# Altium project FHJController_V5.0.PrjPcb (part 1 of 2)
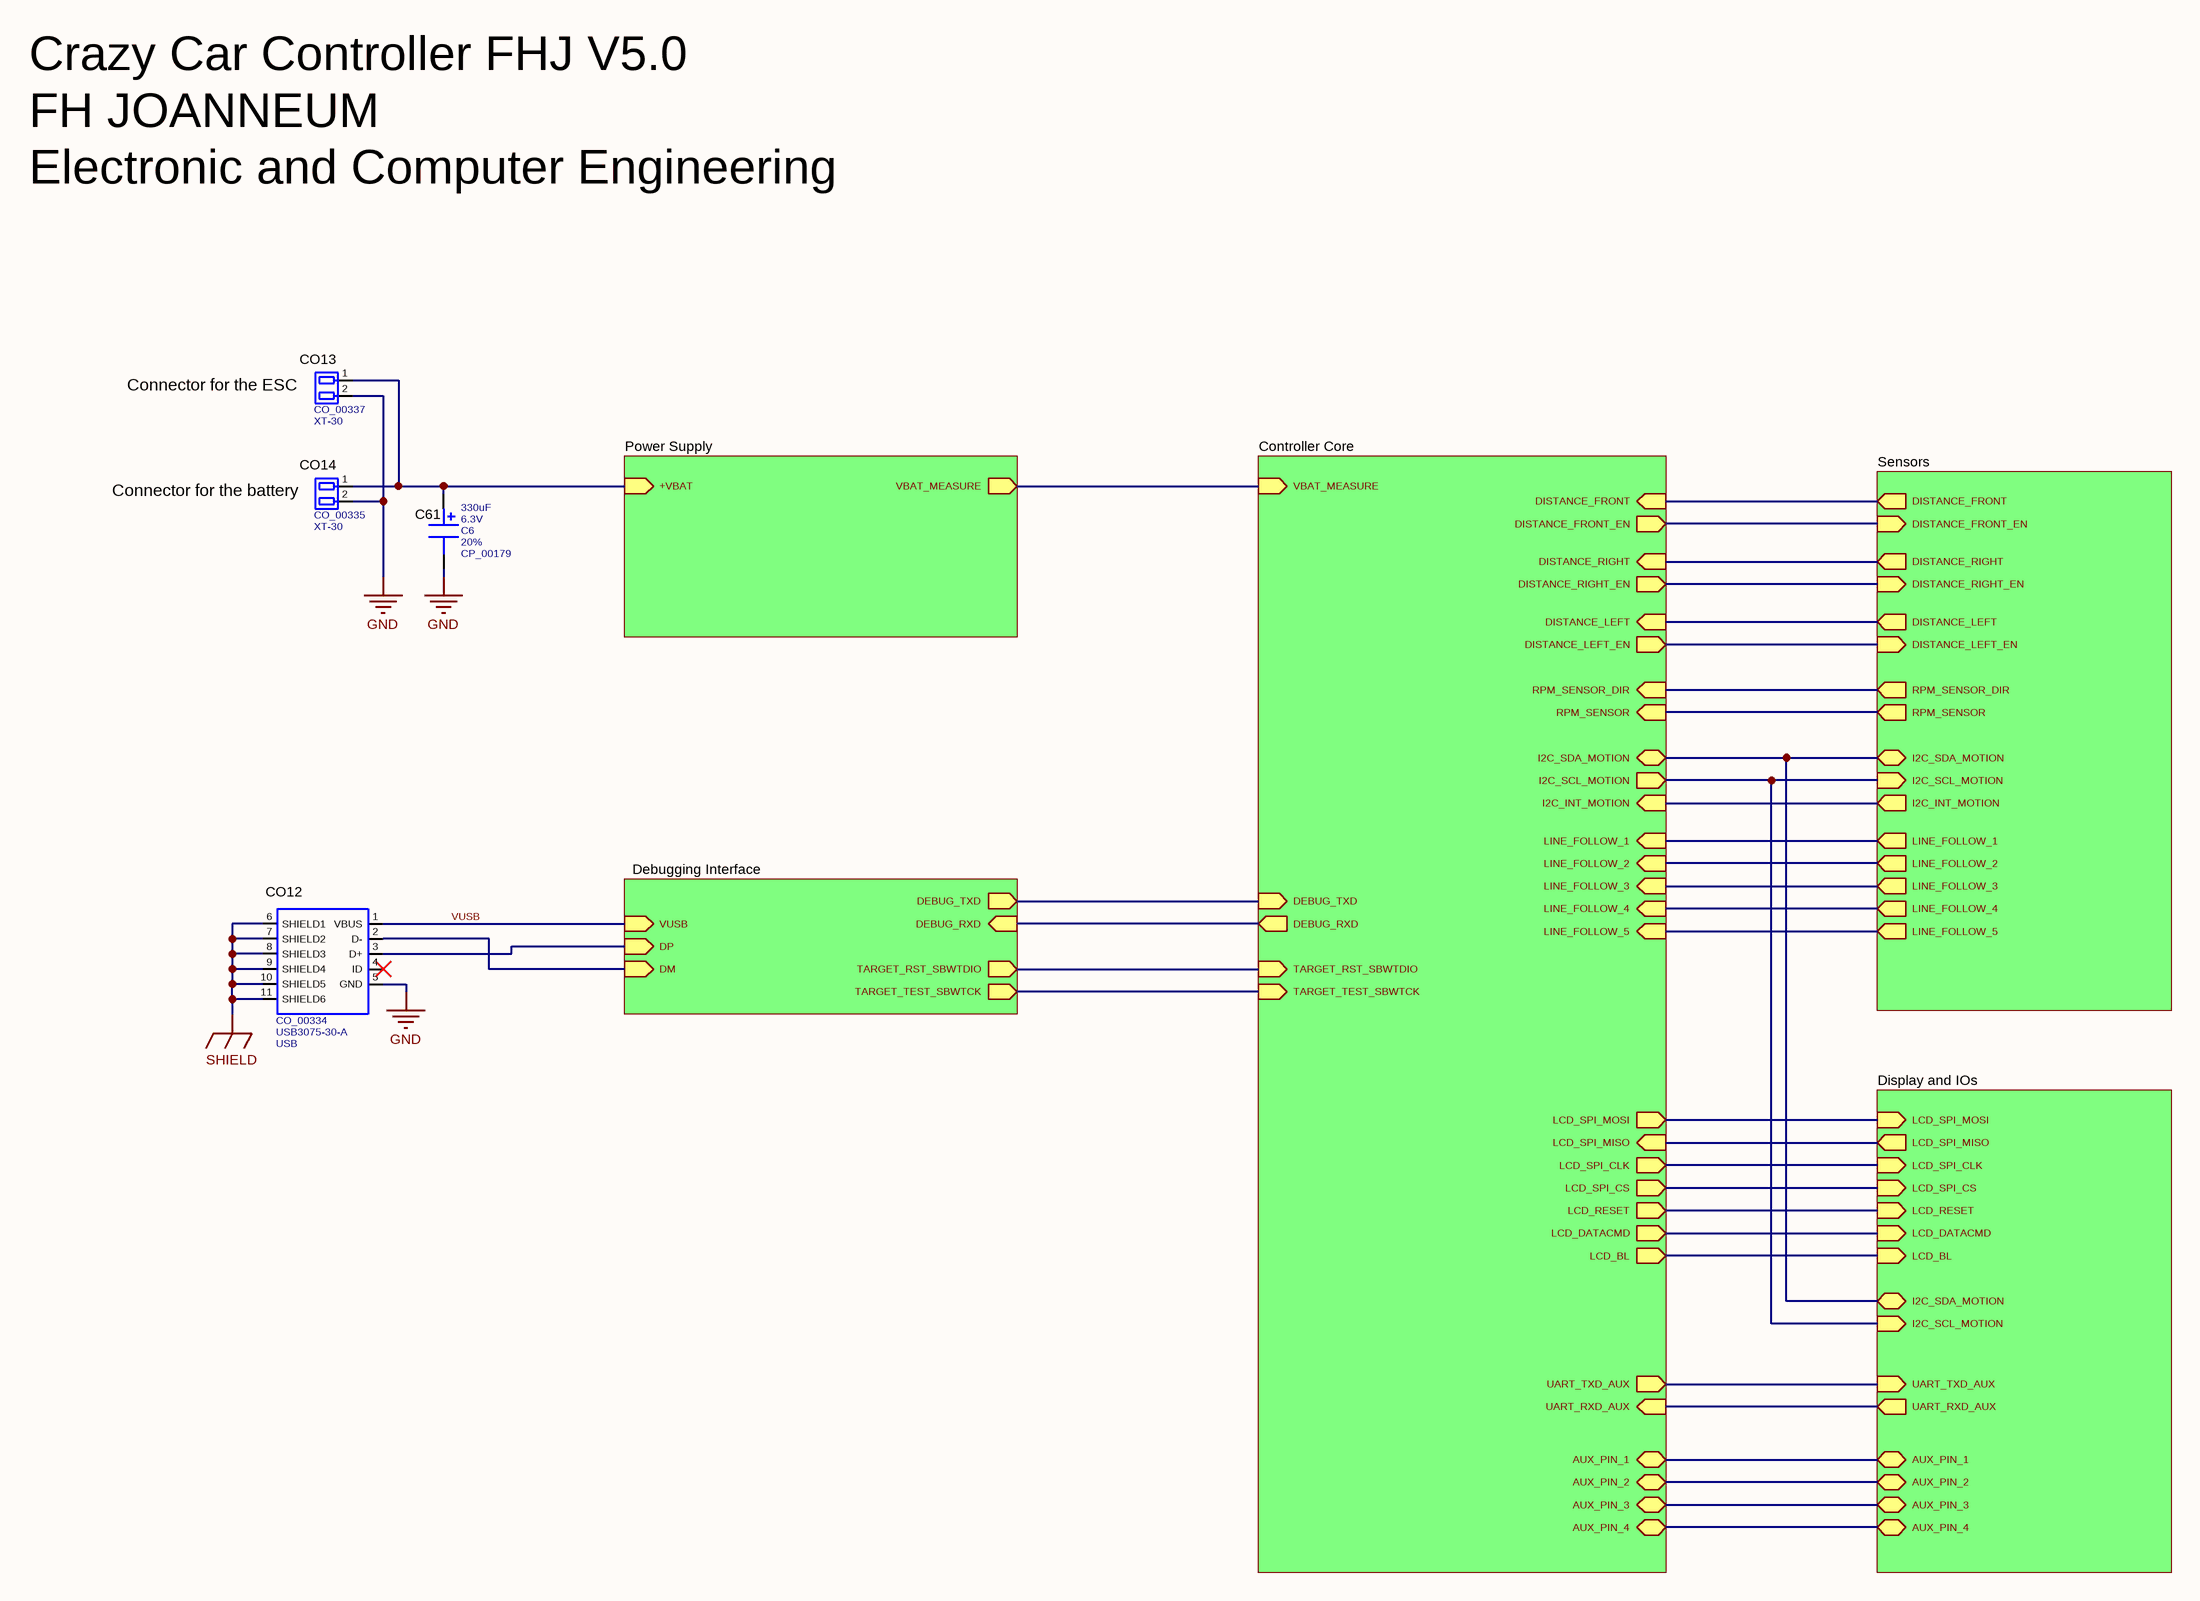
[diagram p0: FHJController_V5.0_Main.SchDoc]
Address1: Werk-VI-Straße 46; Address2: 8605 Kapfenberg; checked: Markus Krenn; CompanyName: FH JOANNEUM; Country: AUSTRIA; drawn: Markus Krenn; ProjectTitle: Crazy Car Controller FHJ; Rev: 5.0
6 sheets, 159 parts. Net scope: hierarchical (ports join the sheet entries above them; power ports are global).
Board file: FHJController_V5.0.PcbDoc
Sheets:
  FHJController_V5.0_Main.SchDoc
     = Power Supply.SchDoc
     = Controller Core.SchDoc
     = Debugging Interface.SchDoc
     = Sensors.SchDoc
     = Display and IOs.SchDoc

## Sheet FHJController_V5.0_Main.SchDoc: Main
size A3; DocumentNumber: 1; SheetNumber: 1; SheetTotal: 6

### Parts
C61  Capacitance: 330uF  Voltage: 6.3V  Package: C6  Tolerance: 20%  Part_Number: CP_00179  [CP_00179L]  (hidden comment: capacitor_polar)
CO12  Manufacturer_Number: USB3075-30-A  Connector_Type: USB  [CO_00334N]  (hidden comment: CO_00334)
CO13  Part_Number: CO_00337  Manufacturer_Number: XT-30  [CO_00337N]  (hidden comment: header1x2)
CO14  Part_Number: CO_00335  Manufacturer_Number: XT-30  [CO_00335N]  (hidden comment: header1x2)

### Sub-sheets
? = Power Supply: +VBAT (in), VBAT_MEASURE (out)
? = Controller Core: LCD_BL (out), UART_RXD_AUX (in), LCD_SPI_CLK (out), DEBUG_RXD (out), LCD_DATACMD (out), LCD_SPI_MOSI (out), LCD_SPI_CS (out), DEBUG_TXD (in), LCD_RESET (out), LCD_SPI_MISO (in), TARGET_RST_SBWTDIO (in), UART_TXD_AUX (out), I2C_SCL_MOTION (out), I2C_INT_MOTION (in), I2C_SDA_MOTION (bidir), RPM_SENSOR (in), RPM_SENSOR_DIR (in), DISTANCE_FRONT (in), DISTANCE_FRONT_EN (out), DISTANCE_RIGHT (in), DISTANCE_RIGHT_EN (out), DISTANCE_LEFT (in), DISTANCE_LEFT_EN (out), VBAT_MEASURE (in), LINE_FOLLOW_1 (in), LINE_FOLLOW_3 (in), LINE_FOLLOW_2 (in), LINE_FOLLOW_4 (in), LINE_FOLLOW_5 (in), TARGET_TEST_SBWTCK (in), AUX_PIN_2 (bidir), AUX_PIN_4 (bidir), AUX_PIN_3 (bidir), AUX_PIN_1 (bidir)
? = Debugging Interface: VUSB (in), DP (in), DM (in), DEBUG_TXD (out), DEBUG_RXD (in), TARGET_TEST_SBWTCK (out), TARGET_RST_SBWTDIO (out)
? = Sensors: RPM_SENSOR_DIR (out), RPM_SENSOR (out), DISTANCE_FRONT (out), DISTANCE_RIGHT (out), DISTANCE_LEFT (out), I2C_SDA_MOTION (bidir), I2C_SCL_MOTION (in), DISTANCE_RIGHT_EN (in), DISTANCE_FRONT_EN (in), DISTANCE_LEFT_EN (in), LINE_FOLLOW_5 (out), LINE_FOLLOW_1 (out), LINE_FOLLOW_3 (out), LINE_FOLLOW_2 (out), LINE_FOLLOW_4 (out), I2C_INT_MOTION (out)
? = Display and IOs: LCD_SPI_CLK (in), UART_TXD_AUX (in), LCD_SPI_MOSI (in), LCD_BL (in), LCD_SPI_CS (in), LCD_DATACMD (in), UART_RXD_AUX (out), LCD_RESET (in), LCD_SPI_MISO (out), I2C_SCL_MOTION (in), I2C_SDA_MOTION (bidir), AUX_PIN_1 (bidir), AUX_PIN_3 (bidir), AUX_PIN_4 (bidir), AUX_PIN_2 (bidir)

### Nets
GND: C61.2(PIN2) CO12.5(GND) CO13.2(PIN2) CO14.2(PIN2)
SHIELD: CO12.6(SHIELD1) CO12.7(SHIELD2) CO12.8(SHIELD3) CO12.9(SHIELD4) CO12.10(SHIELD5) CO12.11(SHIELD6)
AUX_PIN_1: sheet /AUX_PIN_1, sheet /AUX_PIN_1
AUX_PIN_2: sheet /AUX_PIN_2, sheet /AUX_PIN_2
AUX_PIN_3: sheet /AUX_PIN_3, sheet /AUX_PIN_3
AUX_PIN_4: sheet /AUX_PIN_4, sheet /AUX_PIN_4
DEBUG_RXD: sheet /DEBUG_RXD, sheet /DEBUG_RXD
DEBUG_TXD: sheet /DEBUG_TXD, sheet /DEBUG_TXD
DISTANCE_FRONT: sheet /DISTANCE_FRONT, sheet /DISTANCE_FRONT
DISTANCE_FRONT_EN: sheet /DISTANCE_FRONT_EN, sheet /DISTANCE_FRONT_EN
DISTANCE_LEFT: sheet /DISTANCE_LEFT, sheet /DISTANCE_LEFT
DISTANCE_LEFT_EN: sheet /DISTANCE_LEFT_EN, sheet /DISTANCE_LEFT_EN
DISTANCE_RIGHT: sheet /DISTANCE_RIGHT, sheet /DISTANCE_RIGHT
DISTANCE_RIGHT_EN: sheet /DISTANCE_RIGHT_EN, sheet /DISTANCE_RIGHT_EN
I2C_INT_MOTION: sheet /I2C_INT_MOTION, sheet /I2C_INT_MOTION
I2C_SCL_MOTION: sheet /I2C_SCL_MOTION, sheet /I2C_SCL_MOTION, sheet /I2C_SCL_MOTION
I2C_SDA_MOTION: sheet /I2C_SDA_MOTION, sheet /I2C_SDA_MOTION, sheet /I2C_SDA_MOTION
LCD_BL: sheet /LCD_BL, sheet /LCD_BL
LCD_DATACMD: sheet /LCD_DATACMD, sheet /LCD_DATACMD
LCD_RESET: sheet /LCD_RESET, sheet /LCD_RESET
LCD_SPI_CLK: sheet /LCD_SPI_CLK, sheet /LCD_SPI_CLK
LCD_SPI_CS: sheet /LCD_SPI_CS, sheet /LCD_SPI_CS
LCD_SPI_MISO: sheet /LCD_SPI_MISO, sheet /LCD_SPI_MISO
LCD_SPI_MOSI: sheet /LCD_SPI_MOSI, sheet /LCD_SPI_MOSI
LINE_FOLLOW_1: sheet /LINE_FOLLOW_1, sheet /LINE_FOLLOW_1
LINE_FOLLOW_2: sheet /LINE_FOLLOW_2, sheet /LINE_FOLLOW_2
LINE_FOLLOW_3: sheet /LINE_FOLLOW_3, sheet /LINE_FOLLOW_3
LINE_FOLLOW_4: sheet /LINE_FOLLOW_4, sheet /LINE_FOLLOW_4
LINE_FOLLOW_5: sheet /LINE_FOLLOW_5, sheet /LINE_FOLLOW_5
RPM_SENSOR: sheet /RPM_SENSOR, sheet /RPM_SENSOR
RPM_SENSOR_DIR: sheet /RPM_SENSOR_DIR, sheet /RPM_SENSOR_DIR
TARGET_RST_SBWTDIO: sheet /TARGET_RST_SBWTDIO, sheet /TARGET_RST_SBWTDIO
TARGET_TEST_SBWTCK: sheet /TARGET_TEST_SBWTCK, sheet /TARGET_TEST_SBWTCK
UART_RXD_AUX: sheet /UART_RXD_AUX, sheet /UART_RXD_AUX
UART_TXD_AUX: sheet /UART_TXD_AUX, sheet /UART_TXD_AUX
VBAT_MEASURE: sheet /VBAT_MEASURE, sheet /VBAT_MEASURE
VUSB: CO12.1(VBUS) ; sheet /VUSB
NetC61_1: C61.1(PIN1) CO13.1(PIN1) CO14.1(PIN1) ; sheet /+VBAT
NetCO12_2: CO12.2(D-) ; sheet /DM
NetCO12_3: CO12.3(D+) ; sheet /DP

Not connected (* = marked no-connect by the designer): CO12 4(ID)*

### Notes on the sheet
- Crazy Car Controller FHJ V5.0
- FH JOANNEUM
- Electronic and Computer Engineering
- (near CO13) Connector for the ESC
- (near CO14) Connector for the battery
- Size
- A3
- Rev
- Sheet
- of
- Date changed
- FH  JOANNEUM
- University of Applied Sciences
- Drawn by
- Title
- Check by

### Library data of the parts
C61 = CP_00179: Manufacturer_Number: 875105144010; ESR: 0R02; Dielectric_Material: Conductive Polymer Aluminum Solid; Creator: Krenn Markus; Creation_Date: 13.06.2016; Datasheet_Link: http://ibi/dxdb_partdatasheet_download.php?pid=3183
CO12 = CO_00334: Micro-USB Typ B, USB 2.0, Buchse, 5 -polig, Oberflächenmontage, Rechtwinklig; Current: 1A; Impedance: 0R03; Power: 0W; Function_type: Wire-to-Board; Connector_gender: male; Mounting_angle: 90°; Contact_Count: 5; Row_Count: 1; Contact_coating: Gold; Nominal_AC_Voltage: 100VAC; Nominal_DC_Voltage: 100VDC; Mounting: SMD; Material: Copper-Alloy; Creator: Krenn Markus; Part_Number: CO_00334; Creation_Date: 06.06.2016; Datasheet_Link: http://ibi/dxdb_partdatasheet_download.php?pid=3170
CO13 = CO_00337: DYMOND XT-30 BEC Stecker; Current: 5A; Impedance: 0R; Power: 0W; Connector_Type: Terminal Block; Function_type: Wire-to-Board; Connector_gender: female; Pitch_style: 0.005m; Mounting_angle: 0°; Contact_Count: 2; Row_Count: 1; Contact_coating: Gold; Nominal_AC_Voltage: 0VAC; Nominal_DC_Voltage: 0VDC; Mounting: Through Hole; Material: Copper-Alloy; Creator: Krenn Markus; Creation_Date: 10.06.2016; Datasheet_Link: http://ibi/dxdb_partdatasheet_download.php?pid=3181
CO14 = CO_00335: DYMOND XT-30 BEC Stecker; Current: 5A; Impedance: 0R; Power: 0W; Connector_Type: Terminal Block; Function_type: Wire-to-Board; Connector_gender: male; Pitch_style: 0.005m; Mounting_angle: 0°; Contact_Count: 2; Row_Count: 1; Contact_coating: Gold; Nominal_AC_Voltage: 0VAC; Nominal_DC_Voltage: 0VDC; Mounting: Through Hole; Material: Copper-Alloy; Creator: Krenn Markus; Creation_Date: 07.06.2016; Datasheet_Link: http://ibi/dxdb_partdatasheet_download.php?pid=3173

## Sheet Power Supply.SchDoc: Power Supply
size A3; DocumentNumber: 2; SheetNumber: 2; SheetTotal: 6
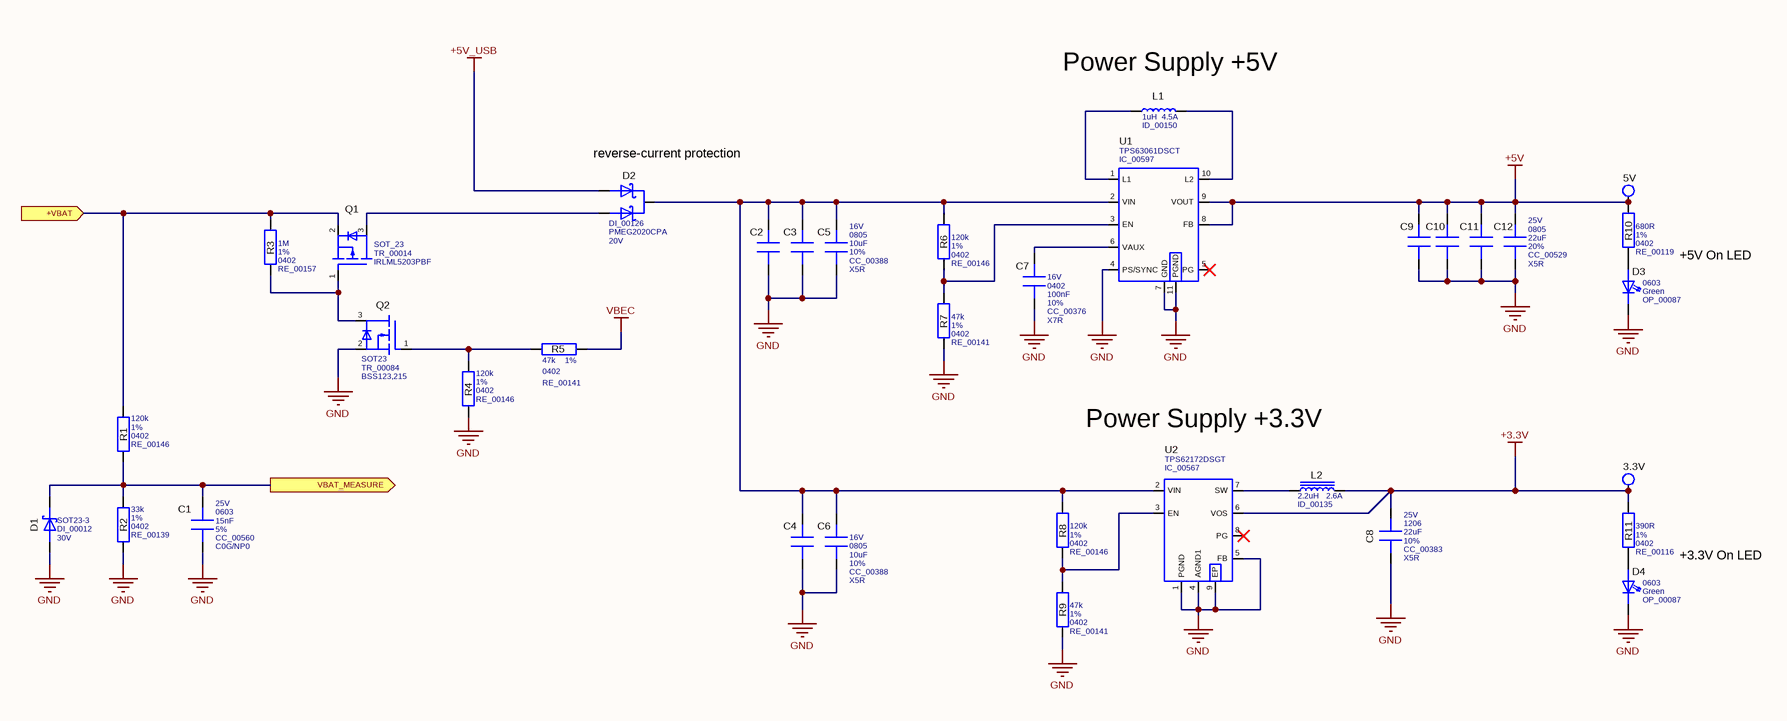
[diagram p1: Power Supply.SchDoc]

### Parts
3.3V  testpoint  [CO_00057N]  (value not drawn)  (no BOM)
5V  testpoint  [CO_00057N]  (value not drawn)  (no BOM)
C1  Voltage: 25V  Package: 0603  Capacitance: 15nF  Tolerance: 5%  Part_Number: CC_00560  Dielectric_Material: C0G/NP0  [CS1600X800X900X350X1250L]  (hidden comment: capacitor)
C2  capacitor  [CS2000x1250x1250x350x1650L]  (value not drawn)
C3  capacitor  [CS2000x1250x1250x350x1650L]  (value not drawn)
C4  capacitor  [CS2000x1250x1250x350x1650L]  (value not drawn)
C5  Voltage: 16V  Package: 0805  Capacitance: 10uF  Tolerance: 10%  Part_Number: CC_00388  Dielectric_Material: X5R  [CS2000x1250x1250x350x1650L]  (hidden comment: capacitor)
C6  Voltage: 16V  Package: 0805  Capacitance: 10uF  Tolerance: 10%  Part_Number: CC_00388  Dielectric_Material: X5R  [CS2000x1250x1250x350x1650L]  (hidden comment: capacitor)
C7  Voltage: 16V  Package: 0402  Capacitance: 100nF  Tolerance: 10%  Part_Number: CC_00376  Dielectric_Material: X7R  [CS1000X500X560X250X820L]  (hidden comment: capacitor)
C8  Voltage: 25V  Package: 1206  Capacitance: 22uF  Tolerance: 10%  Part_Number: CC_00383  Dielectric_Material: X5R  [CS3200x1600x900x500x2700L]  (hidden comment: capacitor)
C9  capacitor  [CS2000x1250x1250x350x1650L]  (value not drawn)
C10  capacitor  [CS2000x1250x1250x350x1650L]  (value not drawn)
C11  capacitor  [CS2000x1250x1250x350x1650L]  (value not drawn)
C12  Voltage: 25V  Package: 0805  Capacitance: 22uF  Tolerance: 20%  Part_Number: CC_00529  Dielectric_Material: X5R  [CS2000x1250x1250x350x1650L]  (hidden comment: capacitor)
D1  Package: SOT23-3  Reverse_Voltage: 30V  [DI_00012N]  (hidden comment: DI_00012)
D2  Manufacturer_Number: PMEG2020CPA  Reverse_Voltage: 20V  [DI_00126N]  (hidden comment: DI_00126)
D3  Package: 0603  Color: Green  Part_Number: OP_00087  [OP_00087L]  (hidden comment: LED)
D4  Package: 0603  Color: Green  Part_Number: OP_00087  [OP_00087L]  (hidden comment: LED)
L1  Inductance: 1uH  Part_Number: ID_00150  Current_DC: 4.5A  [ID_00150N]  (hidden comment: inductor)
L2  Inductance: 2.2uH  Part_Number: ID_00135  Current_DC: 2.6A  [ID_00135N]  (hidden comment: inductor_shielded)
Q1  Package: SOT_23  Part_Number: TR_00014  Manufacturer_Number: IRLML5203PBF  [TR_00014N]  (hidden comment: pmosfet)
Q2  Package: SOT23  Part_Number: TR_00084  Manufacturer_Number: BSS123,215  [TR_00084N]  (hidden comment: nmosfet)
R1  Resistance: 120k  Tolerance: 1%  Package: 0402  Part_Number: RE_00146  [RS1000X500X560X250X820L]  (hidden comment: Resistor)
R2  Resistance: 33k  Tolerance: 1%  Package: 0402  Part_Number: RE_00139  [RS1000X500X560X250X820L]  (hidden comment: Resistor)
R3  Resistance: 1M  Tolerance: 1%  Package: 0402  Part_Number: RE_00157  [RS1000X500X560X250X820L]  (hidden comment: Resistor)
R4  Resistance: 120k  Tolerance: 1%  Package: 0402  Part_Number: RE_00146  [RS1000X500X560X250X820L]  (hidden comment: Resistor)
R5  Resistance: 47k  Tolerance: 1%  Package: 0402  Part_Number: RE_00141  [RS1000X500X560X250X820L]  (hidden comment: Resistor)
R6  Resistance: 120k  Tolerance: 1%  Package: 0402  Part_Number: RE_00146  [RS1000X500X560X250X820L]  (hidden comment: Resistor)
R7  Resistance: 47k  Tolerance: 1%  Package: 0402  Part_Number: RE_00141  [RS1000X500X560X250X820L]  (hidden comment: Resistor)
R8  Resistance: 120k  Tolerance: 1%  Package: 0402  Part_Number: RE_00146  [RS1000X500X560X250X820L]  (hidden comment: Resistor)
R9  Resistance: 47k  Tolerance: 1%  Package: 0402  Part_Number: RE_00141  [RS1000X500X560X250X820L]  (hidden comment: Resistor)
R10  Resistance: 680R  Tolerance: 1%  Package: 0402  Part_Number: RE_00119  [RS1000X500X560X250X820L]  (hidden comment: Resistor)
R11  Resistance: 390R  Tolerance: 1%  Package: 0402  Part_Number: RE_00116  [RS1000X500X560X250X820L]  (hidden comment: Resistor)
U1  Manufacturer_Number: TPS63061DSCT  [IC_00597N]  (hidden comment: IC_00597)
U2  Manufacturer_Number: TPS62172DSGT  [IC_00567N]  (hidden comment: IC_00567)

### Ports
+VBAT (in), VBAT_MEASURE (out)

### Nets
+3.3V: 3.3V.1(PIN1) C8.2(PIN2) L2.2(PIN2) R11.2(PIN2) U2.6(VOS)
+5V: 5V.1(PIN1) C9.2(PIN2) C10.2(PIN2) C11.2(PIN2) C12.2(PIN2) R10.2(PIN2) U1.8(FB) U1.9(VOUT)
+5V_USB: D2.2(A1)
GND: C1.1(PIN1) C2.1(PIN1) C3.1(PIN1) C4.1(PIN1) C5.1(PIN1) C6.1(PIN1) C7.1(PIN1) C8.1(PIN1) C9.1(PIN1) C10.1(PIN1) C11.1(PIN1) C12.1(PIN1) D1.1(ANODE) D3.1(CATHODE) D4.1(CATHODE) Q2.2(S) R2.1(PIN1) R4.1(PIN1) R7.2(PIN2) R9.2(PIN2) U1.4(PS/SYNC) U1.7(GND) U1.11(PGND) U2.1(PGND) U2.4(AGND1) U2.5(FB) U2.9(EP)
VBEC: R5.2(PIN2)
VBAT_MEASURE: C1.2(PIN2) D1.3(CATHODE) R1.1(PIN1) R2.2(PIN2) ; port VBAT_MEASURE
NetC2_2: C2.2(PIN2) C3.2(PIN2) C4.2(PIN2) C5.2(PIN2) C6.2(PIN2) D2.3(C) R6.2(PIN2) R8.2(PIN2) U1.2(VIN) U2.2(VIN)
NetC7_2: C7.2(PIN2) U1.6(VAUX)
NetC61_1: Q1.2(S) R1.2(PIN2) R3.2(PIN2) ; port +VBAT
NetD2_1: D2.1(A) Q1.3(D)
NetD3_2: D3.2(ANODE) R10.1(PIN1)
NetD4_2: D4.2(ANODE) R11.1(PIN1)
NetL1_1: L1.1(PIN1) U1.1(L1)
NetL1_2: L1.2(PIN2) U1.10(L2)
NetL2_1: L2.1(PIN1) U2.7(SW)
NetQ1_1: Q1.1(G) Q2.3(D) R3.1(PIN1)
NetQ2_1: Q2.1(G) R4.2(PIN2) R5.1(PIN1)
NetR6_1: R6.1(PIN1) R7.1(PIN1) U1.3(EN)
NetR8_1: R8.1(PIN1) R9.1(PIN1) U2.3(EN)

Not connected (* = marked no-connect by the designer): U1 5(PG)*; U2 8(PG)*

### Notes on the sheet
- (near L1) Power Supply +5V
- (near D2) reverse-current protection
- +5V On LED
- Power Supply +3.3V
- +3.3V On LED
- Size
- A3
- Rev
- Sheet
- of
- Date changed
- FH  JOANNEUM
- University of Applied Sciences
- Drawn by
- Title
- Check by

### Library data of the parts
3.3V 5V = CO_00057: Testpoint 1.6mm Bohrung 1mm; Current: 0A; Impedance: 0R; Nominal_AC_Voltage: 0VAC; Nominal_DC_Voltage: 0VDC; Power: 0W; Part_Number: CO_00057; Manufacturer_Number: Testpoint; Connector_Type: Testpoint; Creator: Sirnik Heimo; Creation_Date: 09.07.2012; Datasheet_Link: http://ibi/dxdb_partdatasheet_download.php?pid=485
C1 = CC_00560: Part_Type: Fixed capacitors; Manufacturer_Number: C0603C153J3GACTU; Maximum_Capacitance: 0; Creator: Krenn Markus; Minimum_Capacitance: 0; Nominal_Voltage: 0; Creation_Date: 13.06.2016; Datasheet_Link: http://ibi/dxdb_partdatasheet_download.php?pid=3182
C2-C4 = CC_00388: Part_Type: Fixed capacitors; Manufacturer_Number: GRM21BR61C106KE15L; Voltage: 16V; Capacitance: 10uF; Tolerance: 10%; Dielectric_Material: X5R; Maximum_Capacitance: 0; Package: 0805; Creator: Krenn Markus; Part_Number: CC_00388; Minimum_Capacitance: 0; Nominal_Voltage: 0; Creation_Date: 09.07.2012; Datasheet_Link: http://ibi/dxdb_partdatasheet_download.php?pid=388
C5 C6 = CC_00388: Part_Type: Fixed capacitors; Manufacturer_Number: GRM21BR61C106KE15L; Maximum_Capacitance: 0; Creator: Krenn Markus; Minimum_Capacitance: 0; Nominal_Voltage: 0; Creation_Date: 09.07.2012; Datasheet_Link: http://ibi/dxdb_partdatasheet_download.php?pid=388
C7 = CC_00376: Part_Type: Fixed capacitors; Manufacturer_Number: GRM155R71C104KA88D; Maximum_Capacitance: 0; Creator: Okorn Robert; Minimum_Capacitance: 0; Nominal_Voltage: 0; Creation_Date: 09.07.2012; Datasheet_Link: http://ibi/dxdb_partdatasheet_download.php?pid=376
C8 = CC_00383: Part_Type: Fixed capacitors; Manufacturer_Number: GRM31CR61E226KE15L; Maximum_Capacitance: 0; Creator: Neissl Gernot; Minimum_Capacitance: 0; Nominal_Voltage: 0; Creation_Date: 09.07.2012; Datasheet_Link: http://ibi/dxdb_partdatasheet_download.php?pid=383
C9-C11 = CC_00529: Part_Type: Fixed capacitors; Manufacturer_Number: GRM21BR61E226ME44L; Voltage: 25V; Capacitance: 22uF; Tolerance: 20%; Dielectric_Material: X5R; Maximum_Capacitance: 0; Package: 0805; Creator: Neissl Gernot; Part_Number: CC_00529; Minimum_Capacitance: 0; Nominal_Voltage: 0; Creation_Date: 05.02.2015; Datasheet_Link: http://ibi/dxdb_partdatasheet_download.php?pid=2855
C12 = CC_00529: Part_Type: Fixed capacitors; Manufacturer_Number: GRM21BR61E226ME44L; Maximum_Capacitance: 0; Creator: Neissl Gernot; Minimum_Capacitance: 0; Nominal_Voltage: 0; Creation_Date: 05.02.2015; Datasheet_Link: http://ibi/dxdb_partdatasheet_download.php?pid=2855
D1 = DI_00012: BAR43 - Schottky Diode, 30V, 100mA; Manufacturer_Number: BAR43FILM; Material: Silicon; Power: 0W; Diodes_per_package: 1; Forward_Voltage: 330mV; Reverse-recovery_time: 5ns; Creator: Krenn Markus; Part_Number: DI_00012; Diode_type: Schottky Diode; Current_DC: 100mA; Creation_Date: 09.07.2012; Datasheet_Link: http://ibi/dxdb_partdatasheet_download.php?pid=777
D2 = DI_00126: 2 A low V F  dual MEGA Schottky barrier rectifier; Material: Silicon; Power: 500mW; Diode_type: Schottky Diode; Current_DC: 2A; Diodes_per_package: 2; Forward_Voltage: 385mV; Reverse-recovery_time: 55ns; Creator: Krenn Markus; Part_Number: DI_00126; Creation_Date: 09.06.2016; Datasheet_Link: http://ibi/dxdb_partdatasheet_download.php?pid=3180
D3 D4 = OP_00087: Manufacturer_Number: TLMG1100-GS08; Type: Standard; Isolating_voltage: 0; Creator: Krenn Markus; Part_Type: LED; Transistor_type: 0; Creation_Date: 23.05.2016; Datasheet_Link: http://ibi/dxdb_partdatasheet_download.php?pid=3140
L1 = ID_00150: Manufacturer_Number: XFL4020-102MEC; Part_Type: Inductors; Creator: Krenn Markus; Creation_Date: 07.06.2016; Datasheet_Link: http://ibi/dxdb_partdatasheet_download.php?pid=3175
L2 = ID_00135: Manufacturer_Number: SDR0403-2R2ML; Part_Type: Inductors; Creator: Krenn Markus; Creation_Date: 01.07.2015; Datasheet_Link: http://ibi/dxdb_partdatasheet_download.php?pid=3002
Q1 = TR_00014: Part_Type: MOSFET; Current: 0; Drain-Source_DC_current: 3A; Drain-Source_Voltage: -30V; Creator: Neissl Gernot; Collector-Emitter_voltage: 0; Reverse_voltage: 0; RMS_Current: 0; Creation_Date: 09.07.2012; Datasheet_Link: http://ibi/dxdb_partdatasheet_download.php?pid=2091
Q2 = TR_00084: Part_Type: MOSFET; Current: 0; Drain-Source_DC_current: 150mA; Drain-Source_Voltage: 100V; Creator: Weis Gerald; Collector-Emitter_voltage: 0; Reverse_voltage: 0; RMS_Current: 0; Creation_Date: 07.04.2016; Datasheet_Link: http://ibi/dxdb_partdatasheet_download.php?pid=3103
R1 R4 R6 R8 = RE_00146: Manufacturer_Number: RC0402FR-07120KL; Part_Type: Fixed Resistors; Maximum_Resistance: 0; Nominal_voltage: 50V; Type: 0; Creator: Krenn Markus; Nominal_DC_Voltage: 0; Impact_current: 0; Creation_Date: 09.07.2012; Datasheet_Link: http://ibi/dxdb_partdatasheet_download.php?pid=1551
R2 = RE_00139: Manufacturer_Number: MC00625W0402133K; Part_Type: Fixed Resistors; Maximum_Resistance: 0; Nominal_voltage: 50V; Type: 0; Creator: Krenn Markus; Nominal_DC_Voltage: 0; Impact_current: 0; Creation_Date: 09.07.2012; Datasheet_Link: http://ibi/dxdb_partdatasheet_download.php?pid=1544
R3 = RE_00157: Manufacturer_Number: MC00625W040211M; Part_Type: Fixed Resistors; Maximum_Resistance: 0; Nominal_voltage: 50V; Type: 0; Creator: Krenn Markus; Nominal_DC_Voltage: 0; Impact_current: 0; Creation_Date: 09.07.2012; Datasheet_Link: http://ibi/dxdb_partdatasheet_download.php?pid=1562
R5 R7 R9 = RE_00141: Manufacturer_Number: MC00625W0402147K; Part_Type: Fixed Resistors; Maximum_Resistance: 0; Nominal_voltage: 50V; Type: 0; Creator: Krenn Markus; Nominal_DC_Voltage: 0; Impact_current: 0; Creation_Date: 09.07.2012; Datasheet_Link: http://ibi/dxdb_partdatasheet_download.php?pid=1546
R10 = RE_00119: Manufacturer_Number: MC00625W04021680R; Part_Type: Fixed Resistors; Maximum_Resistance: 0; Nominal_voltage: 50V; Type: 0; Nominal_DC_Voltage: 0; Impact_current: 0; Creator: Krenn Markus; Creation_Date: 09.07.2012; Datasheet_Link: http://ibi/dxdb_partdatasheet_download.php?pid=1524
R11 = RE_00116: Manufacturer_Number: MC00625W04021390R; Part_Type: Fixed Resistors; Maximum_Resistance: 0; Nominal_voltage: 50V; Type: 0; Creator: Krenn Markus; Nominal_DC_Voltage: 0; Impact_current: 0; Creation_Date: 09.07.2012; Datasheet_Link: http://ibi/dxdb_partdatasheet_download.php?pid=1521
U1 = IC_00597: TPS62172DSGT - Step-Down Converter with DCS-Control; Part_Type: Switching Regulators and Controllers; Creator: Krenn Markus; Part_Number: IC_00597; Creation_Date: 18.05.2016; Datasheet_Link: http://ibi/dxdb_partdatasheet_download.php?pid=3137
U2 = IC_00567: TPS62172DSGT - Step-Down Converter with DCS-Control; Part_Type: Switching Regulators and Controllers; Creator: Krenn Markus; Part_Number: IC_00567; Creation_Date: 30.06.2015; Datasheet_Link: http://ibi/dxdb_partdatasheet_download.php?pid=3001

## Sheet Controller Core.SchDoc: MSP430 Core
size A3; PageSetup: Record=PageOptions|CenterHorizontal=True|CenterVertical=True|PrintScale=1.00|XCorrection=1.00|YCorrection=1.00|PrintKind=1|BorderSize=5000000|LeftOffset=0|BottomOffset=0|Orientation=2|PaperLength=1000|PaperWidth=1000|Scale=100|PaperSource=7|PrintQuality=-3|MediaType=1|DitherType=10|PrintScaleMode=1|PaperKind=A3|PaperIndex=8; DocumentNumber: 3; SheetNumber: 3; SheetTotal: 6
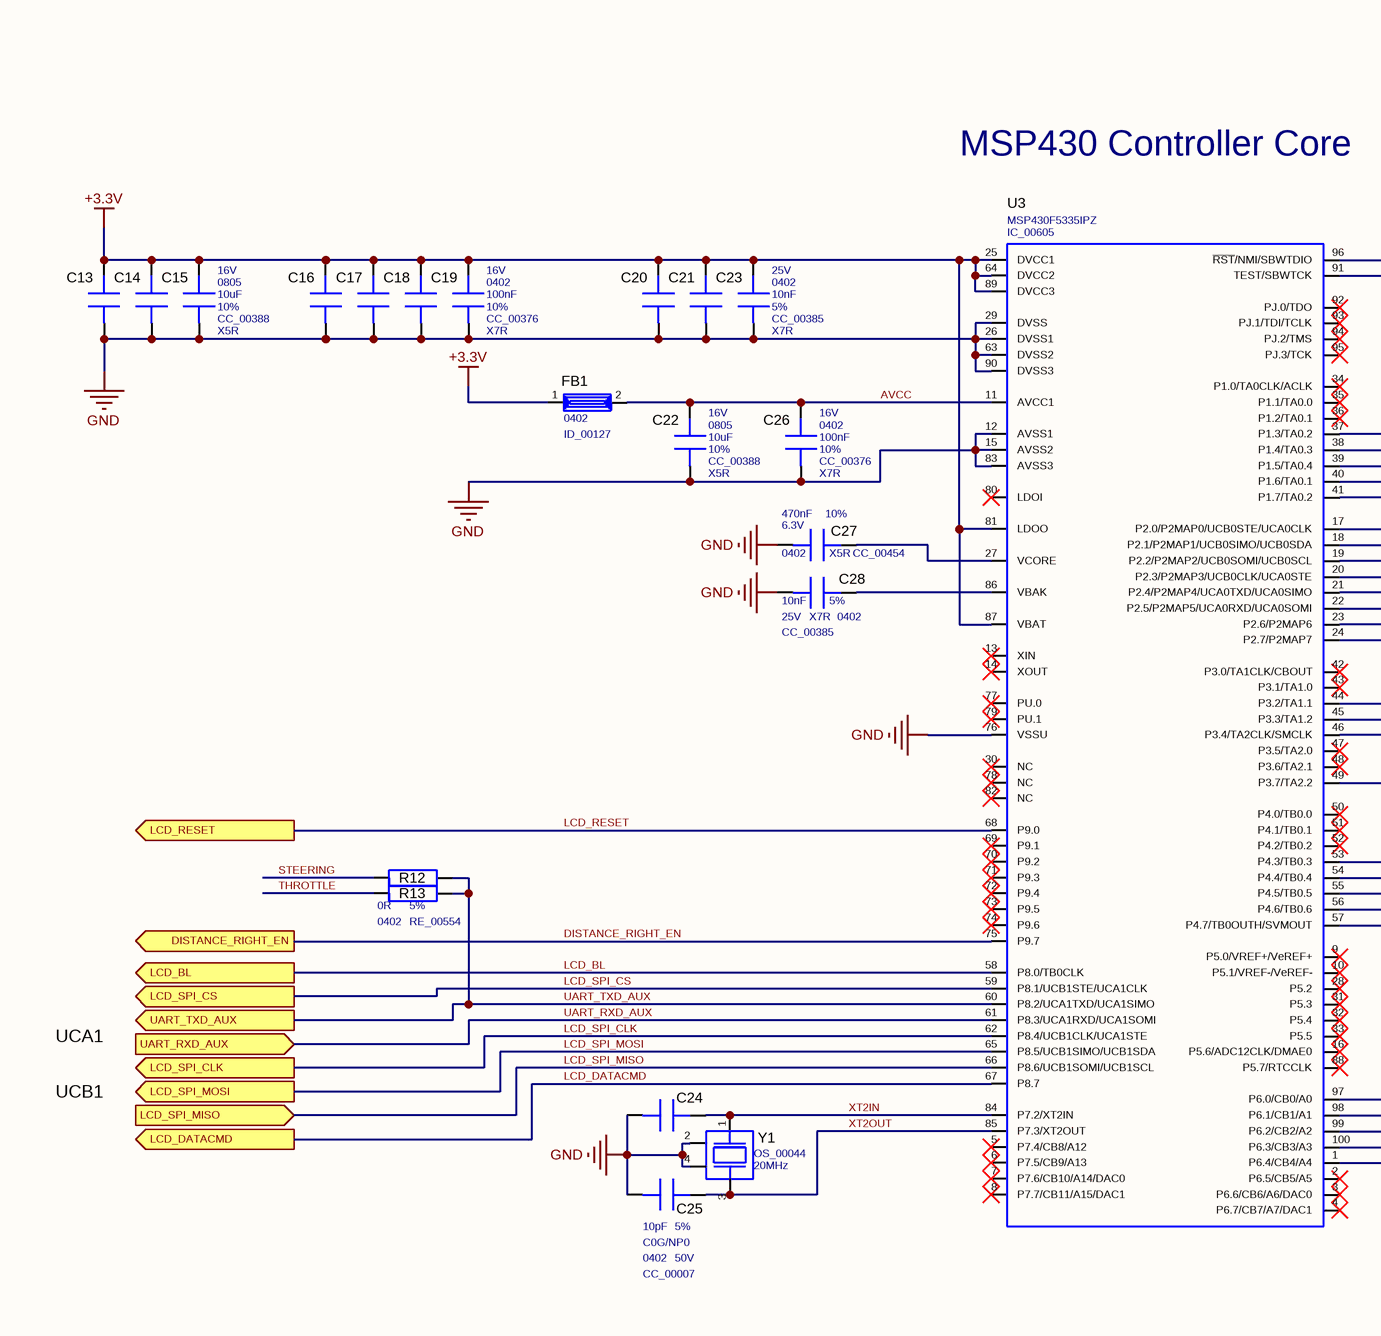
[diagram p2: Controller Core.SchDoc, left]
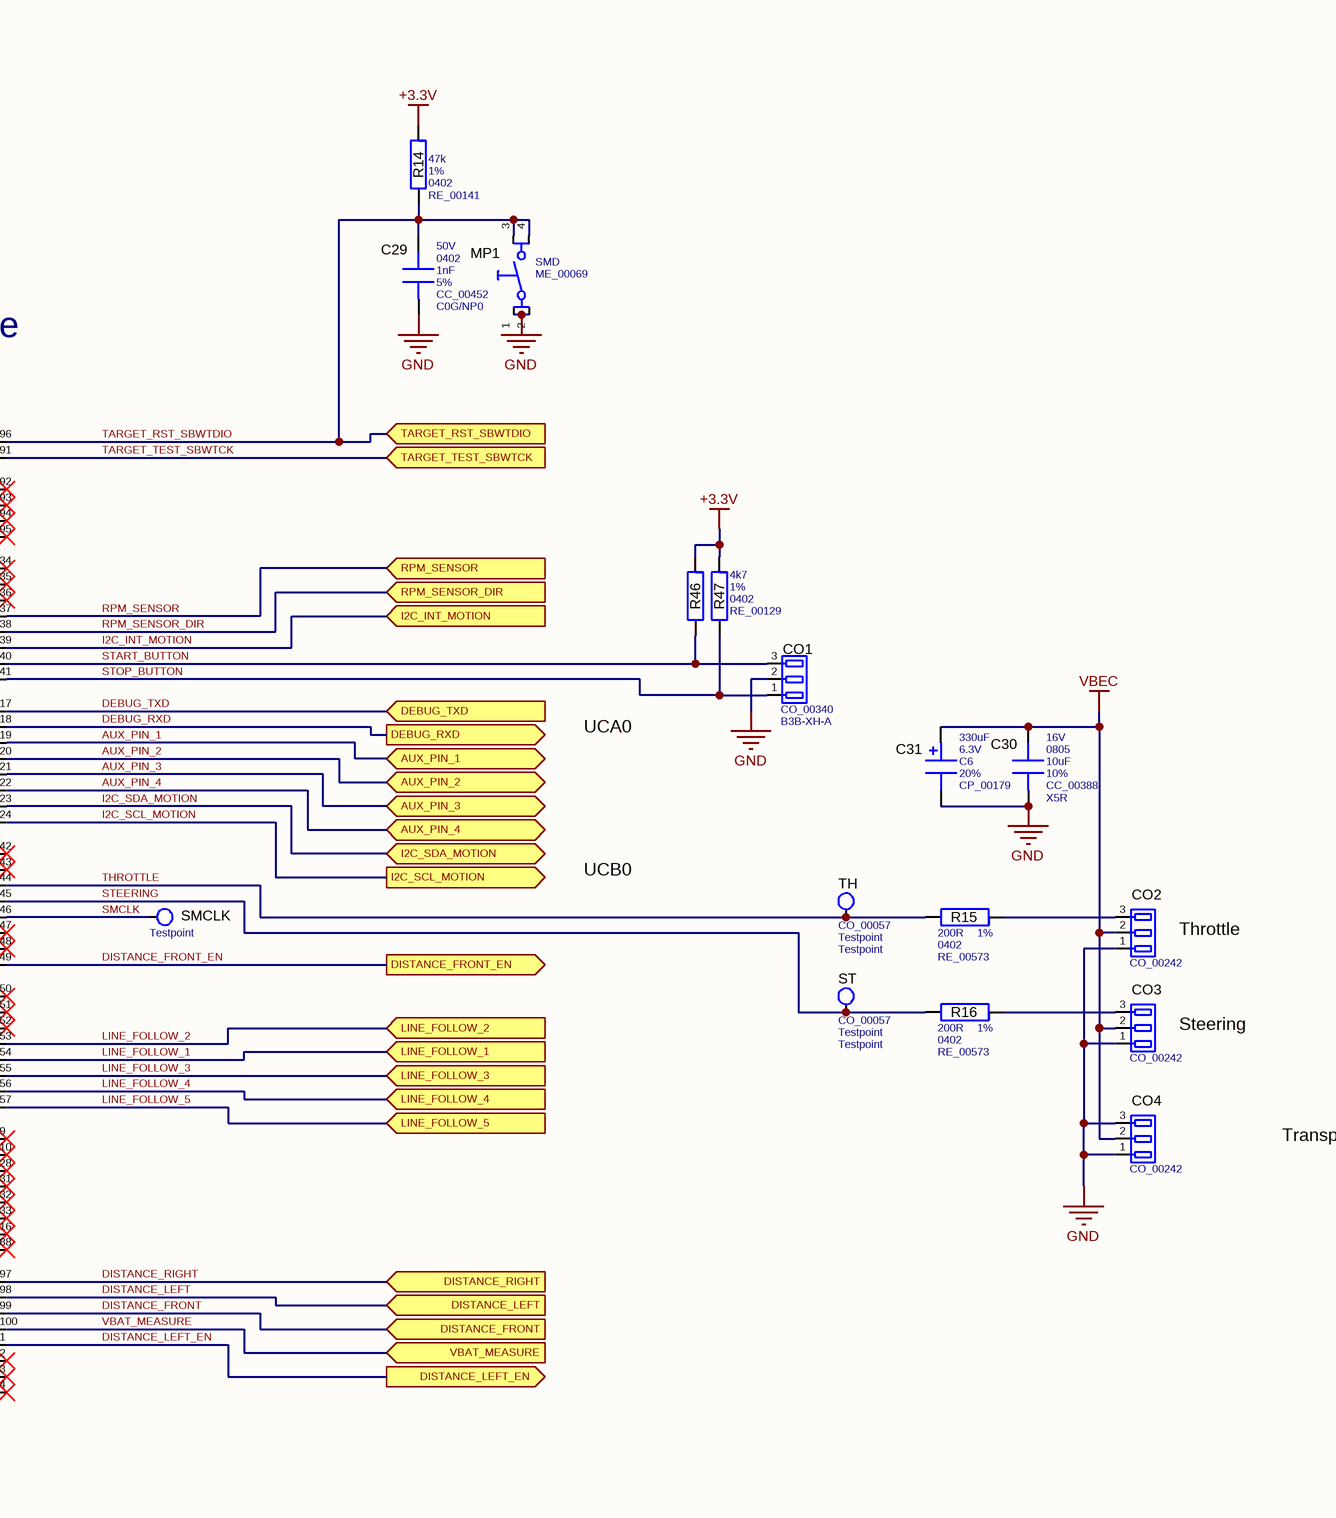
[diagram p3: Controller Core.SchDoc, right]

### Parts
C13  capacitor  [CS2000x1250x1250x350x1650L]  (value not drawn)
C14  capacitor  [CS2000x1250x1250x350x1650L]  (value not drawn)
C15  Voltage: 16V  Package: 0805  Capacitance: 10uF  Tolerance: 10%  Part_Number: CC_00388  Dielectric_Material: X5R  [CS2000x1250x1250x350x1650L]  (hidden comment: capacitor)
C16  capacitor  [CS1000X500X560X250X820L]  (value not drawn)
C17  capacitor  [CS1000X500X560X250X820L]  (value not drawn)
C18  capacitor  [CS1000X500X560X250X820L]  (value not drawn)
C19  Voltage: 16V  Package: 0402  Capacitance: 100nF  Tolerance: 10%  Part_Number: CC_00376  Dielectric_Material: X7R  [CS1000X500X560X250X820L]  (hidden comment: capacitor)
C20  capacitor  [CS1000X500X560X250X820L]  (value not drawn)
C21  capacitor  [CS1000X500X560X250X820L]  (value not drawn)
C22  Voltage: 16V  Package: 0805  Capacitance: 10uF  Tolerance: 10%  Part_Number: CC_00388  Dielectric_Material: X5R  [CS2000x1250x1250x350x1650L]  (hidden comment: capacitor)
C23  Voltage: 25V  Package: 0402  Capacitance: 10nF  Tolerance: 5%  Part_Number: CC_00385  Dielectric_Material: X7R  [CS1000X500X560X250X820L]  (hidden comment: capacitor)
C24  capacitor  [CS1000X500X560X250X820L]  (value not drawn)
C25  Voltage: 50V  Package: 0402  Capacitance: 10pF  Tolerance: 5%  Part_Number: CC_00007  Dielectric_Material: C0G/NP0  [CS1000X500X560X250X820L]  (hidden comment: capacitor)
C26  Voltage: 16V  Package: 0402  Capacitance: 100nF  Tolerance: 10%  Part_Number: CC_00376  Dielectric_Material: X7R  [CS1000X500X560X250X820L]  (hidden comment: capacitor)
C27  Voltage: 6.3V  Package: 0402  Capacitance: 470nF  Tolerance: 10%  Part_Number: CC_00454  Dielectric_Material: X5R  [CS1000X500X560X250X820L]  (hidden comment: capacitor)
C28  Voltage: 25V  Package: 0402  Capacitance: 10nF  Tolerance: 5%  Part_Number: CC_00385  Dielectric_Material: X7R  [CS1000X500X560X250X820L]  (hidden comment: capacitor)
C29  Voltage: 50V  Package: 0402  Capacitance: 1nF  Tolerance: 5%  Part_Number: CC_00452  Dielectric_Material: C0G/NP0  [CS1000X500X560X250X820L]  (hidden comment: capacitor)
C30  Voltage: 16V  Package: 0805  Capacitance: 10uF  Tolerance: 10%  Part_Number: CC_00388  Dielectric_Material: X5R  [CS2000x1250x1250x350x1650L]  (hidden comment: capacitor)
C31  Capacitance: 330uF  Voltage: 6.3V  Package: C6  Tolerance: 20%  Part_Number: CP_00179  [CP_00179L]  (hidden comment: capacitor_polar)
CO1  Part_Number: CO_00340  Manufacturer_Number: B3B-XH-A  [CO_00340N]  (hidden comment: header1x3)
CO2  Part_Number: CO_00242  [CO_00242N]  (hidden comment: header1x3)
CO3  Part_Number: CO_00242  [CO_00242N]  (hidden comment: header1x3)
CO4  Part_Number: CO_00242  [CO_00242N]  (hidden comment: header1x3)
FB1  Package: 0402  Part_Number: ID_00127  [IS1000x500x500x200x800L]  (hidden comment: ferrit)
MP1  Package: SMD  Part_Number: ME_00069  [ME_00069N]  (hidden comment: pushbutton_dpst)
R12  Resistor  [RS1000X500X560X250X820L]  (value not drawn)
R13  Resistance: 0R  Tolerance: 5%  Package: 0402  Part_Number: RE_00554  [RS1000X500X560X250X820L]  (hidden comment: Resistor)
R14  Resistance: 47k  Tolerance: 1%  Package: 0402  Part_Number: RE_00141  [RS1000X500X560X250X820L]  (hidden comment: Resistor)
R15  Resistance: 200R  Tolerance: 1%  Package: 0402  Part_Number: RE_00573  [RS1000X500X560X250X820L]  (hidden comment: Resistor)
R16  Resistance: 200R  Tolerance: 1%  Package: 0402  Part_Number: RE_00573  [RS1000X500X560X250X820L]  (hidden comment: Resistor)
R46  Resistor  [RS1000X500X560X250X820L]  (value not drawn)
R47  Resistance: 4k7  Tolerance: 1%  Package: 0402  Part_Number: RE_00129  [RS1000X500X560X250X820L]  (hidden comment: Resistor)
SMCLK  testpoint  [CO_00057N]  (no BOM)
ST  Part_Number: CO_00057  [CO_00057N]  (hidden comment: testpoint)  (no BOM)
TH  Part_Number: CO_00057  [CO_00057N]  (hidden comment: testpoint)  (no BOM)
U3  Manufacturer_Number: MSP430F5335IPZ  [IC_00605N]  (hidden comment: IC_00605)
Y1  Nominal_frequency: 20MHz  [OS_00044N]  (hidden comment: OS_00044)

### Ports
AUX_PIN_1 (bidir), AUX_PIN_2 (bidir), AUX_PIN_3 (bidir), AUX_PIN_4 (bidir), DEBUG_RXD (out), DEBUG_TXD (in), DISTANCE_FRONT (in), DISTANCE_FRONT_EN (out), DISTANCE_LEFT (in), DISTANCE_LEFT_EN (out), DISTANCE_RIGHT (in), DISTANCE_RIGHT_EN (out), I2C_INT_MOTION (in), I2C_SCL_MOTION (out), I2C_SDA_MOTION (bidir), LCD_BL (out), LCD_DATACMD (out), LCD_RESET (out), LCD_SPI_CLK (out), LCD_SPI_CS (out), LCD_SPI_MISO (in), LCD_SPI_MOSI (out), LINE_FOLLOW_1 (in), LINE_FOLLOW_2 (in), LINE_FOLLOW_3 (in), LINE_FOLLOW_4 (in), LINE_FOLLOW_5 (in), RPM_SENSOR (in), RPM_SENSOR_DIR (in), TARGET_RST_SBWTDIO (in), TARGET_TEST_SBWTCK (in), UART_RXD_AUX (in), UART_TXD_AUX (out), VBAT_MEASURE (in)

### Nets
+3.3V: C13.2(PIN2) C14.2(PIN2) C15.2(PIN2) C16.2(PIN2) C17.2(PIN2) C18.2(PIN2) C19.2(PIN2) C20.2(PIN2) C21.2(PIN2) C23.2(PIN2) FB1.1(PIN1) R14.2(PIN2) R46.2(PIN2) R47.2(PIN2) U3.25(DVCC1) U3.64(DVCC2) U3.81(LDOO) U3.87(VBAT) U3.89(DVCC3)
GND: C13.1(PIN1) C14.1(PIN1) C15.1(PIN1) C16.1(PIN1) C17.1(PIN1) C18.1(PIN1) C19.1(PIN1) C20.1(PIN1) C21.1(PIN1) C22.1(PIN1) C23.1(PIN1) C24.1(PIN1) C25.1(PIN1) C26.1(PIN1) C27.1(PIN1) C28.1(PIN1) C29.1(PIN1) C30.1(PIN1) C31.2(PIN2) CO1.2(PIN2) CO2.1(PIN1) CO3.1(PIN1) CO4.1(PIN1) CO4.3(PIN3) MP1.1(PIN1) MP1.2(PIN2) U3.12(AVSS1) U3.15(AVSS2) U3.26(DVSS1) U3.29(DVSS) U3.63(DVSS2) U3.76(VSSU) U3.83(AVSS3) U3.90(DVSS3) Y1.2(PIN2) Y1.4(PIN4)
VBEC: C30.2(PIN2) C31.1(PIN1) CO2.2(PIN2) CO3.2(PIN2) CO4.2(PIN2)
AUX_PIN_1: U3.19(P2.2/P2MAP2/UCB0SOMI/UCB0SCL) ; port AUX_PIN_1
AUX_PIN_2: U3.20(P2.3/P2MAP3/UCB0CLK/UCA0STE) ; port AUX_PIN_2
AUX_PIN_3: U3.21(P2.4/P2MAP4/UCA0TXD/UCA0SIMO) ; port AUX_PIN_3
AUX_PIN_4: U3.22(P2.5/P2MAP5/UCA0RXD/UCA0SOMI) ; port AUX_PIN_4
AVCC: C22.2(PIN2) C26.2(PIN2) FB1.2(PIN2) U3.11(AVCC1)
DEBUG_RXD: U3.18(P2.1/P2MAP1/UCB0SIMO/UCB0SDA) ; port DEBUG_RXD
DEBUG_TXD: U3.17(P2.0/P2MAP0/UCB0STE/UCA0CLK) ; port DEBUG_TXD
DISTANCE_FRONT: U3.99(P6.2/CB2/A2) ; port DISTANCE_FRONT
DISTANCE_FRONT_EN: U3.49(P3.7/TA2.2) ; port DISTANCE_FRONT_EN
DISTANCE_LEFT: U3.98(P6.1/CB1/A1) ; port DISTANCE_LEFT
DISTANCE_LEFT_EN: U3.1(P6.4/CB4/A4) ; port DISTANCE_LEFT_EN
DISTANCE_RIGHT: U3.97(P6.0/CB0/A0) ; port DISTANCE_RIGHT
DISTANCE_RIGHT_EN: U3.75(P9.7) ; port DISTANCE_RIGHT_EN
I2C_INT_MOTION: U3.39(P1.5/TA0.4) ; port I2C_INT_MOTION
I2C_SCL_MOTION: U3.24(P2.7/P2MAP7) ; port I2C_SCL_MOTION
I2C_SDA_MOTION: U3.23(P2.6/P2MAP6) ; port I2C_SDA_MOTION
LCD_BL: U3.58(P8.0/TB0CLK) ; port LCD_BL
LCD_DATACMD: U3.67(P8.7) ; port LCD_DATACMD
LCD_RESET: U3.68(P9.0) ; port LCD_RESET
LCD_SPI_CLK: U3.62(P8.4/UCB1CLK/UCA1STE) ; port LCD_SPI_CLK
LCD_SPI_CS: U3.59(P8.1/UCB1STE/UCA1CLK) ; port LCD_SPI_CS
LCD_SPI_MISO: U3.66(P8.6/UCB1SOMI/UCB1SCL) ; port LCD_SPI_MISO
LCD_SPI_MOSI: U3.65(P8.5/UCB1SIMO/UCB1SDA) ; port LCD_SPI_MOSI
LINE_FOLLOW_1: U3.54(P4.4/TB0.4) ; port LINE_FOLLOW_1
LINE_FOLLOW_2: U3.53(P4.3/TB0.3) ; port LINE_FOLLOW_2
LINE_FOLLOW_3: U3.55(P4.5/TB0.5) ; port LINE_FOLLOW_3
LINE_FOLLOW_4: U3.56(P4.6/TB0.6) ; port LINE_FOLLOW_4
LINE_FOLLOW_5: U3.57(P4.7/TB0OUTH/SVMOUT) ; port LINE_FOLLOW_5
RPM_SENSOR: U3.37(P1.3/TA0.2) ; port RPM_SENSOR
RPM_SENSOR_DIR: U3.38(P1.4/TA0.3) ; port RPM_SENSOR_DIR
SMCLK: SMCLK.1(PIN1) U3.46(P3.4/TA2CLK/SMCLK)
START_BUTTON: CO1.3(PIN3) R46.1(PIN1) U3.40(P1.6/TA0.1)
STEERING: R12.2(PIN2) R16.1(PIN1) ST.1(PIN1) U3.45(P3.3/TA1.2)
STOP_BUTTON: CO1.1(PIN1) R47.1(PIN1) U3.41(P1.7/TA0.2)
TARGET_RST_SBWTDIO: C29.2(PIN2) MP1.3(PIN3) MP1.4(PIN4) R14.1(PIN1) U3.96(~{RST}/NMI/SBWTDIO) ; port TARGET_RST_SBWTDIO
TARGET_TEST_SBWTCK: U3.91(TEST/SBWTCK) ; port TARGET_TEST_SBWTCK
THROTTLE: R13.2(PIN2) R15.1(PIN1) TH.1(PIN1) U3.44(P3.2/TA1.1)
UART_RXD_AUX: U3.61(P8.3/UCA1RXD/UCA1SOMI) ; port UART_RXD_AUX
UART_TXD_AUX: R12.1(PIN1) R13.1(PIN1) U3.60(P8.2/UCA1TXD/UCA1SIMO) ; port UART_TXD_AUX
VBAT_MEASURE: U3.100(P6.3/CB3/A3) ; port VBAT_MEASURE
XT2IN: C24.2(PIN2) U3.84(P7.2/XT2IN) Y1.1(PIN1)
XT2OUT: C25.2(PIN2) U3.85(P7.3/XT2OUT) Y1.3(PIN3)
NetC27_2: C27.2(PIN2) U3.27(VCORE)
NetC28_2: C28.2(PIN2) U3.86(VBAK)
NetCO2_3: CO2.3(PIN3) R15.2(PIN2)
NetCO3_3: CO3.3(PIN3) R16.2(PIN2)

Not connected (* = marked no-connect by the designer): U3 2(P6.5/CB5/A5)* 3(P6.6/CB6/A6/DAC0)* 4(P6.7/CB7/A7/DAC1)* 5(P7.4/CB8/A12)* 6(P7.5/CB9/A13)* 7(P7.6/CB10/A14/DAC0)* 8(P7.7/CB11/A15/DAC1)* 9(P5.0/VREF+/VeREF+)* 10(P5.1/VREF-/VeREF-)* 13(XIN)* 14(XOUT)* 16(P5.6/ADC12CLK/DMAE0)* 28(P5.2)* 30(NC)* 31(P5.3)* 32(P5.4)* 33(P5.5)* 34(P1.0/TA0CLK/ACLK)* 35(P1.1/TA0.0)* 36(P1.2/TA0.1)* 42(P3.0/TA1CLK/CBOUT)* 43(P3.1/TA1.0)* 47(P3.5/TA2.0)* 48(P3.6/TA2.1)* 50(P4.0/TB0.0)* 51(P4.1/TB0.1)* 52(P4.2/TB0.2)* 69(P9.1)* 70(P9.2)* 71(P9.3)* 72(P9.4)* 73(P9.5)* 74(P9.6)* 77(PU.0)* 78(NC)* 79(PU.1)* 80(LDOI)* 82(NC)* 88(P5.7/RTCCLK)* 92(PJ.0/TDO)* 93(PJ.1/TDI/TCLK)* 94(PJ.2/TMS)* 95(PJ.3/TCK)*

### Notes on the sheet
- MSP430 Controller Core
- UCA0
- UCB0
- (near CO2) Throttle
- (near CO3) Steering
- (near CO4) Transponder
- UCA1
- UCB1
- Size
- A3
- Rev
- Sheet
- of
- Date changed
- FH  JOANNEUM
- University of Applied Sciences
- Drawn by
- Title
- Check by

### Library data of the parts
C13 C14 = CC_00388: as C2 on sheet Power Supply; Package: 0805; Creator: Krenn Markus; Part_Number: CC_00388; Minimum_Capacitance: 0; Nominal_Voltage: 0; Creation_Date: 09.07.2012; Datasheet_Link: http://ibi/dxdb_partdatasheet_download.php?pid=388
C15 C22 C30 = CC_00388: as C5 on sheet Power Supply; Creator: Krenn Markus; Minimum_Capacitance: 0; Nominal_Voltage: 0; Creation_Date: 09.07.2012; Datasheet_Link: http://ibi/dxdb_partdatasheet_download.php?pid=388
C16-C18 = CC_00376: Part_Type: Fixed capacitors; Manufacturer_Number: GRM155R71C104KA88D; Voltage: 16V; Capacitance: 100nF; Tolerance: 10%; Dielectric_Material: X7R; Maximum_Capacitance: 0; Package: 0402; Creator: Okorn Robert; Part_Number: CC_00376; Minimum_Capacitance: 0; Nominal_Voltage: 0; Creation_Date: 09.07.2012; Datasheet_Link: http://ibi/dxdb_partdatasheet_download.php?pid=376
C19 C26 = CC_00376: as C7 on sheet Power Supply; Creator: Okorn Robert; Minimum_Capacitance: 0; Nominal_Voltage: 0; Creation_Date: 09.07.2012; Datasheet_Link: http://ibi/dxdb_partdatasheet_download.php?pid=376
C20 C21 = CC_00385: Part_Type: Fixed capacitors; Manufacturer_Number: C0402C103J3RACTU; Voltage: 25V; Capacitance: 10nF; Tolerance: 5%; Dielectric_Material: X7R; Maximum_Capacitance: 0; Package: 0402; Creator: Neissl Gernot; Part_Number: CC_00385; Minimum_Capacitance: 0; Nominal_Voltage: 0; Creation_Date: 09.07.2012; Datasheet_Link: http://ibi/dxdb_partdatasheet_download.php?pid=385
C23 C28 = CC_00385: Part_Type: Fixed capacitors; Manufacturer_Number: C0402C103J3RACTU; Maximum_Capacitance: 0; Creator: Neissl Gernot; Minimum_Capacitance: 0; Nominal_Voltage: 0; Creation_Date: 09.07.2012; Datasheet_Link: http://ibi/dxdb_partdatasheet_download.php?pid=385
C24 = CC_00007: Part_Type: Fixed capacitors; Manufacturer_Number: MC0402N100D500CT; Voltage: 50V; Capacitance: 10pF; Tolerance: 5%; Dielectric_Material: C0G/NP0; Maximum_Capacitance: 0; Package: 0402; Creator: Krenn Markus; Part_Number: CC_00007; Minimum_Capacitance: 0; Nominal_Voltage: 0; Creation_Date: 09.07.2012; Datasheet_Link: http://ibi/dxdb_partdatasheet_download.php?pid=7
C25 = CC_00007: Part_Type: Fixed capacitors; Manufacturer_Number: MC0402N100D500CT; Maximum_Capacitance: 0; Creator: Krenn Markus; Minimum_Capacitance: 0; Nominal_Voltage: 0; Creation_Date: 09.07.2012; Datasheet_Link: http://ibi/dxdb_partdatasheet_download.php?pid=7
C27 = CC_00454: Part_Type: Fixed capacitors; Manufacturer_Number: 04026D474KAT2A; Maximum_Capacitance: 0; Creator: Krenn Markus; Minimum_Capacitance: 0; Nominal_Voltage: 0; Creation_Date: 04.01.2013; Datasheet_Link: http://ibi/dxdb_partdatasheet_download.php?pid=2152
C29 = CC_00452: Part_Type: Fixed capacitors; Manufacturer_Number: C1005C0G1H102J050BA; Maximum_Capacitance: 0; Creator: Krenn Markus; Minimum_Capacitance: 0; Nominal_Voltage: 0; Creation_Date: 04.01.2013; Datasheet_Link: http://ibi/dxdb_partdatasheet_download.php?pid=2150
C31 = CP_00179: as C61 on sheet FHJController_V5.0_Main; Creator: Krenn Markus; Creation_Date: 13.06.2016; Datasheet_Link: http://ibi/dxdb_partdatasheet_download.php?pid=3183
CO1 = CO_00340: XH connector - Disconnectable Crimp style connectors; Current: 3A; Impedance: 0R01; Power: 0W; Connector_Type: Pin-Header; Function_type: Wire-to-Board; Connector_gender: male; Pitch_style: 0.0025m; Mounting_angle: 0°; Contact_Count: 3; Row_Count: 1; Contact_coating: Tin; Nominal_AC_Voltage: 250VAC; Nominal_DC_Voltage: 250VDC; Mounting: Through Hole; Material: Copper-Alloy; Creator: Krenn Markus; Creation_Date: 20.06.2016; Datasheet_Link: http://ibi/dxdb_partdatasheet_download.php?pid=3194
CO2-CO4 = CO_00242: THROUGH-HOLE .025" SQ POST HEADER; Manufacturer_Number: TSW-103-07-G-S; Current: 6A; Impedance: 0R; Power: 0W; Connector_Type: Pin-Header; Function_type: Board-to-Board; Connector_gender: male; Pitch_style: 0.00254m; Mounting_angle: 0°; Contact_Count: 3; Row_Count: 1; Contact_coating: Gold; Nominal_AC_Voltage: 450VAC; Nominal_DC_Voltage: 450VDC; Mounting: Through Hole; Material: Phosphor-Bronze; Creator: Krenn Markus; Creation_Date: 30.01.2014; Datasheet_Link: http://ibi/dxdb_partdatasheet_download.php?pid=2387
FB1 = ID_00127: Manufacturer_Number: BLM15AG601SN1; Part_Type: Inductors; Inductance: 0H; Current_DC: 300mA; Creator: Krenn Markus; Creation_Date: 29.01.2015; Datasheet_Link: http://ibi/dxdb_partdatasheet_download.php?pid=2836
MP1 = ME_00069: Manufacturer_Number: EVQQ2W02W; Part_Type: Switches; Current: 20mA; Nominal_coil_current: 0; Nominal_DC_Voltage: 15VDC; Creator: Krenn Markus; Nominal_Coil_Voltage: 0; Nominal_current: 0; Creation_Date: 17.06.2016; Datasheet_Link: http://ibi/dxdb_partdatasheet_download.php?pid=3189
R12 = RE_00554: Manufacturer_Number: RC0402JR-070RL; Part_Type: Fixed Resistors; Resistance: 0R; Tolerance: 5%; Maximum_Resistance: 0; Nominal_voltage: 50V; Package: 0402; Type: 0; Creator: Okorn Robert; Part_Number: RE_00554; Nominal_DC_Voltage: 0; Impact_current: 0; Creation_Date: 09.07.2012; Datasheet_Link: http://ibi/dxdb_partdatasheet_download.php?pid=1959
R13 = RE_00554: Manufacturer_Number: RC0402JR-070RL; Part_Type: Fixed Resistors; Maximum_Resistance: 0; Nominal_voltage: 50V; Type: 0; Creator: Okorn Robert; Nominal_DC_Voltage: 0; Impact_current: 0; Creation_Date: 09.07.2012; Datasheet_Link: http://ibi/dxdb_partdatasheet_download.php?pid=1959
R14 = RE_00141: as R5 on sheet Power Supply; Type: 0; Creator: Krenn Markus; Nominal_DC_Voltage: 0; Impact_current: 0; Creation_Date: 09.07.2012; Datasheet_Link: http://ibi/dxdb_partdatasheet_download.php?pid=1546
R15 R16 = RE_00573: Manufacturer_Number: CRCW0402200RFKED; Part_Type: Fixed Resistors; Maximum_Resistance: 0; Nominal_voltage: 50V; Type: 0; Creator: Neissl Gernot; Nominal_DC_Voltage: 0; Impact_current: 0; Creation_Date: 09.07.2012; Datasheet_Link: http://ibi/dxdb_partdatasheet_download.php?pid=1978
R46 = RE_00129: Manufacturer_Number: MC00625W040214K7; Part_Type: Fixed Resistors; Resistance: 4k7; Tolerance: 1%; Maximum_Resistance: 0; Nominal_voltage: 50V; Package: 0402; Part_Number: RE_00129; Type: 0; Nominal_DC_Voltage: 0; Impact_current: 0; Creator: Krenn Markus; Creation_Date: 09.07.2012; Datasheet_Link: http://ibi/dxdb_partdatasheet_download.php?pid=1534
R47 = RE_00129: Manufacturer_Number: MC00625W040214K7; Part_Type: Fixed Resistors; Maximum_Resistance: 0; Nominal_voltage: 50V; Type: 0; Nominal_DC_Voltage: 0; Impact_current: 0; Creator: Krenn Markus; Creation_Date: 09.07.2012; Datasheet_Link: http://ibi/dxdb_partdatasheet_download.php?pid=1534
SMCLK ST TH = CO_00057: as 3.3V on sheet Power Supply; Manufacturer_Number: Testpoint; Connector_Type: Testpoint; Creator: Sirnik Heimo; Creation_Date: 09.07.2012; Datasheet_Link: http://ibi/dxdb_partdatasheet_download.php?pid=485
  SMCLK: Part_Number: CO_00057
U3 = IC_00605: MSP430F5335IPZ - MSP430F533x Mixed-Signal Microcontrollers; Part_Type: Microcontrollers/Processors; Package: LQFP100; Creator: Krenn Markus; Part_Number: IC_00605; Creation_Date: 02.06.2016; Datasheet_Link: http://ibi/dxdb_partdatasheet_download.php?pid=3165
Y1 = OS_00044: ABM8G-20.000MHZ-4Y-T3 - ULTRA MINIATURE CERAMIC GLASS SEALED SMD CRYSTAL; Tolerance: 30ppm; Creator: Krenn Markus; Part_Number: OS_00044; Manufacturer_Number: ABM8G-20.000MHZ-4Y-T3; Part_Type: Crystal; Creation_Date: 17.06.2016; Datasheet_Link: http://ibi/dxdb_partdatasheet_download.php?pid=3188